# Altium schematic sheet D02-2-00 Circuit Top Sheet.SchDoc
size A3; SheetNumber: 1; SheetTotal: 3
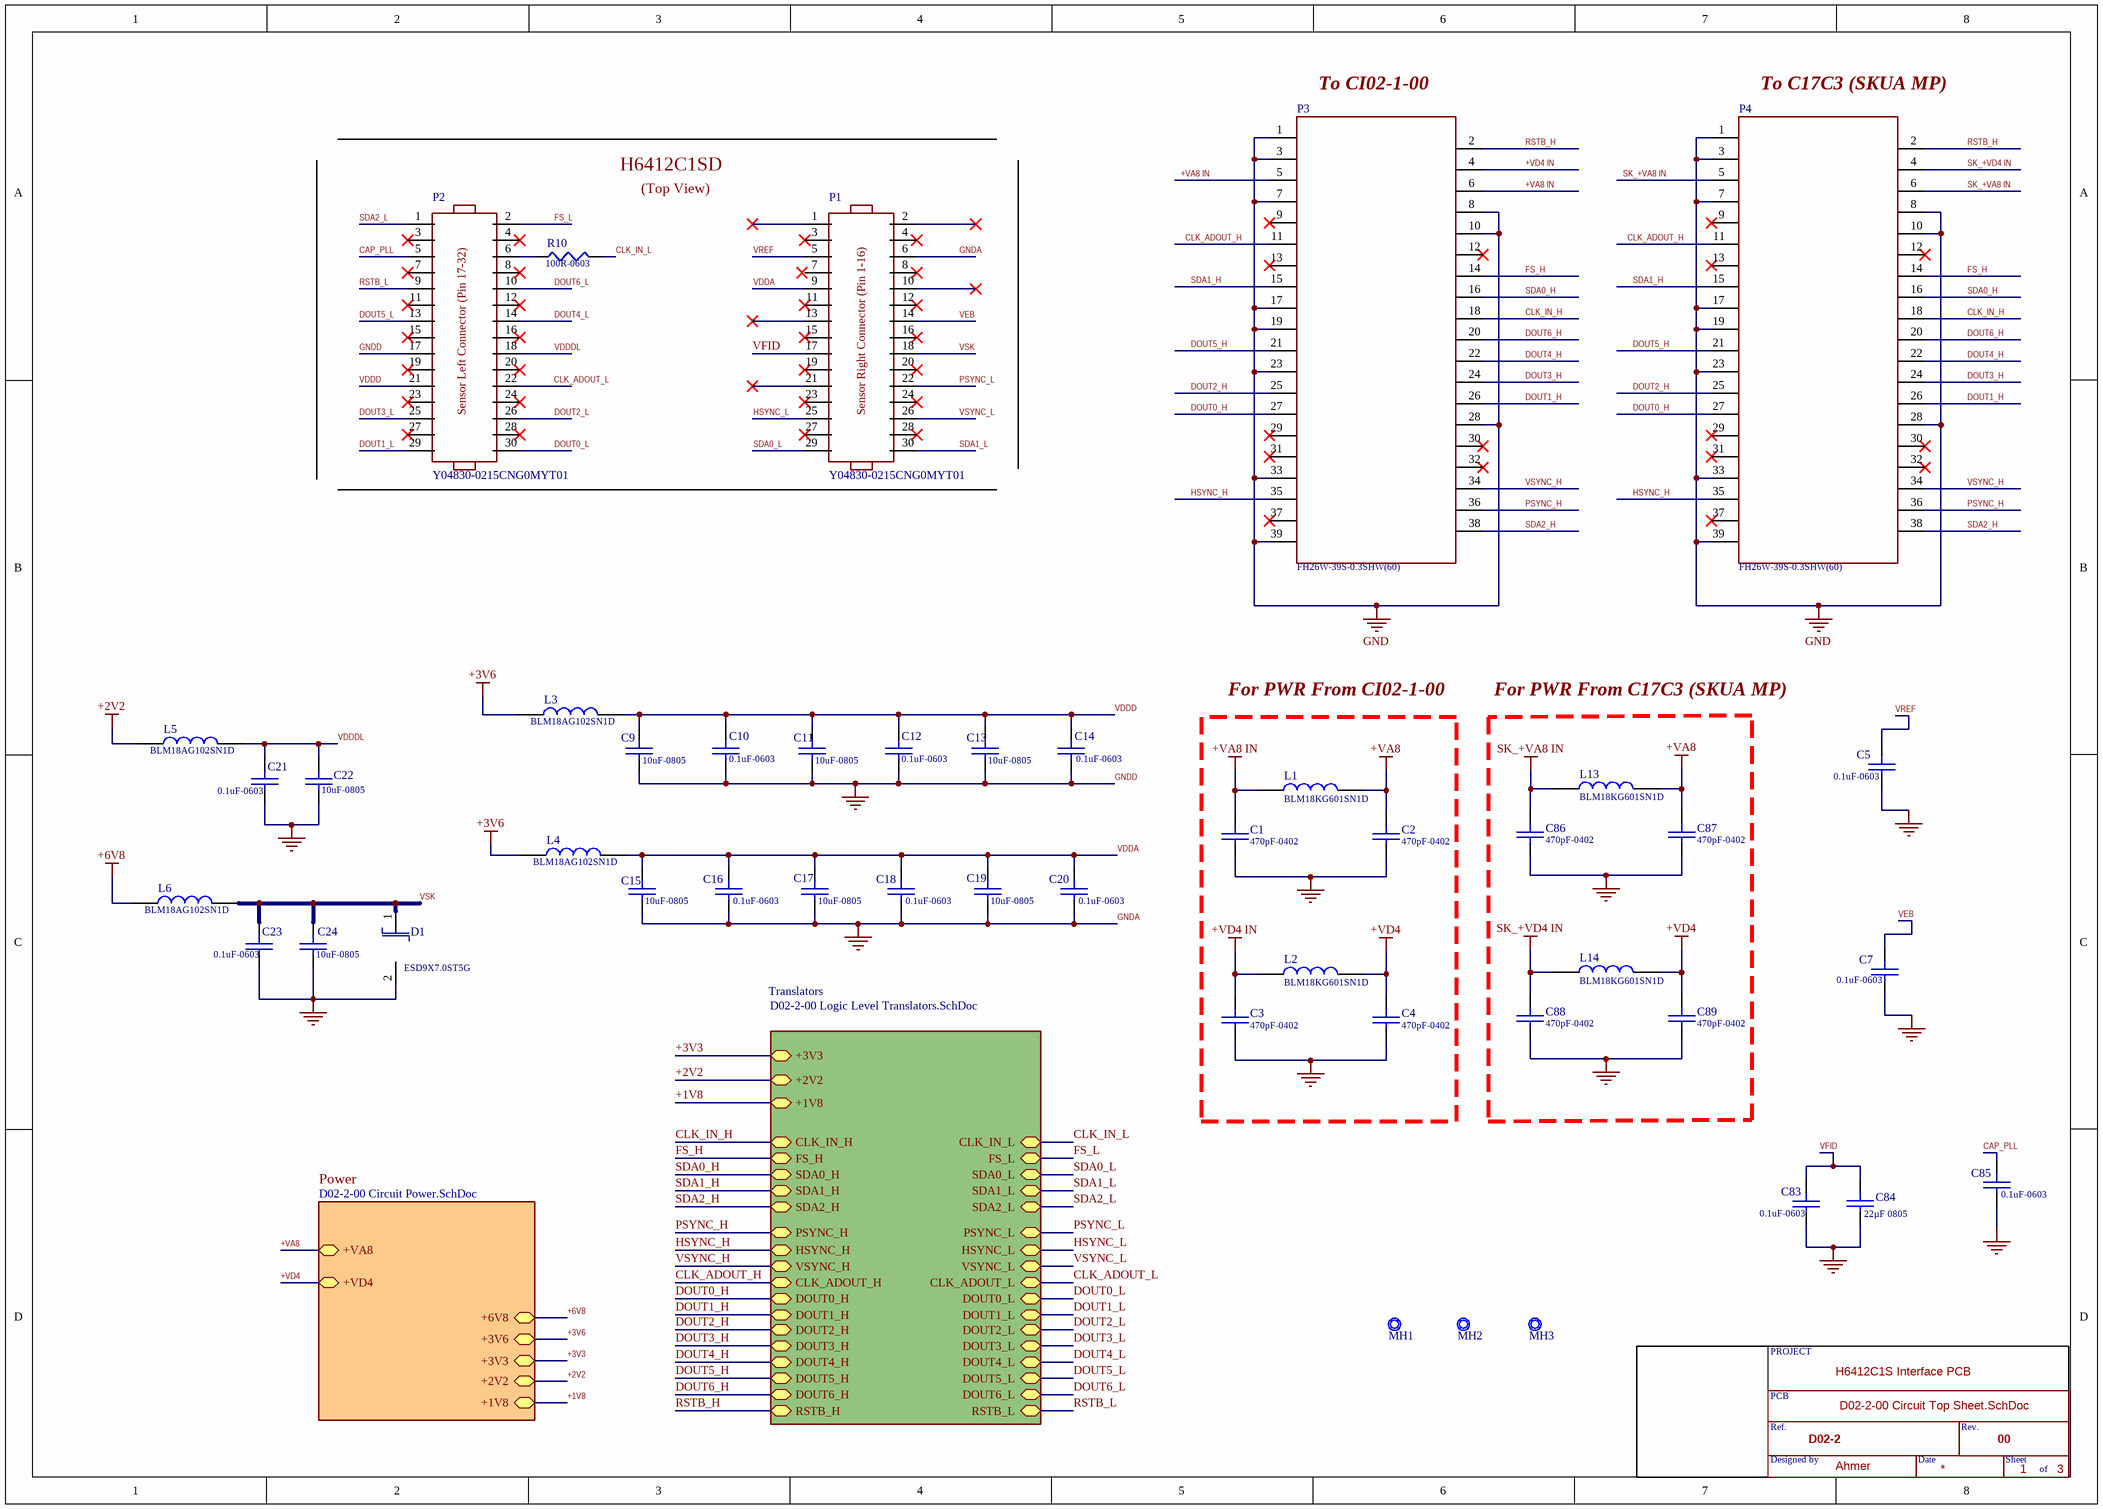
[diagram p0: D02-2-00 Circuit Top Sheet.SchDoc]

## Parts
*?  Title Box  (value not drawn)
C1  470pF-0402  [C0402 - C0402C104J4RACTU]
C2  470pF-0402  [C0402 - C0402C104J4RACTU]
C3  470pF-0402  [C0402 - C0402C104J4RACTU]
C4  470pF-0402  [C0402 - C0402C104J4RACTU]
C5  0.1uF-0603  [C0603X104J4RECAUTO]
C7  0.1uF-0603  [C0603X104J4RECAUTO]
C9  10uF-0805  [C0805]
C10  0.1uF-0603  [C0603X104J4RECAUTO]
C11  10uF-0805  [C0805]
C12  0.1uF-0603  [C0603X104J4RECAUTO]
C13  10uF-0805  [C0805]
C14  0.1uF-0603  [C0603X104J4RECAUTO]
C15  10uF-0805  [C0805]
C16  0.1uF-0603  [C0603X104J4RECAUTO]
C17  10uF-0805  [C0805]
C18  0.1uF-0603  [C0603X104J4RECAUTO]
C19  10uF-0805  [C0805]
C20  0.1uF-0603  [C0603X104J4RECAUTO]
C21  0.1uF-0603  [C0603X104J4RECAUTO]
C22  10uF-0805  [C0805]
C23  0.1uF-0603  [C0603X104J4RECAUTO]
C24  10uF-0805  [C0805]
C83  0.1uF-0603  [C0603X104J4RECAUTO]
C84  22µF 0805  [C-0805]
C85  0.1uF-0603  [C0603X104J4RECAUTO]
C86  470pF-0402  [C0402 - C0402C104J4RACTU]
C87  470pF-0402  [C0402 - C0402C104J4RACTU]
C88  470pF-0402  [C0402 - C0402C104J4RACTU]
C89  470pF-0402  [C0402 - C0402C104J4RACTU]
D1  ESD9X7.0ST5G  [SOD-923 for ESD9X12ST5G]
L1  BLM18KG601SN1D  [BLM18K]
L2  BLM18KG601SN1D  [BLM18K]
L3  BLM18AG102SN1D  [BLM18AG102SN1D]
L4  BLM18AG102SN1D  [BLM18AG102SN1D]
L5  BLM18AG102SN1D  [BLM18AG102SN1D]
L6  BLM18AG102SN1D  [BLM18AG102SN1D]
L13  BLM18KG601SN1D  [BLM18K]
L14  BLM18KG601SN1D  [BLM18K]
MH1  Mounting Hole 3.2-2.5  [MH 3.2mm-2.5mm]  (value not drawn)
MH2  Mounting Hole 3.2-2.5  [MH 3.2mm-2.5mm]  (value not drawn)
MH3  Mounting Hole 3.2-2.5  [MH 3.2mm-2.5mm]  (value not drawn)
P1  Y04830-0215CNG0MYT01  [Y04830-0215CNG0MYT01]
P2  Y04830-0215CNG0MYT01  [Y04830-0215CNG0MYT01]
P3  FH26W-39S-0.3SHW(60)  [FH26W-39S-0.3SHW(60)]
P4  FH26W-39S-0.3SHW(60)  [FH26W-39S-0.3SHW(60)]
R10  100R-0603  [R0603]

## Sub-sheets
Power = D02-2-00 Circuit Power.SchDoc: +VA8 (bidir), +VD4 (bidir), +6V8 (bidir), +3V6 (bidir), +3V3 (bidir), +2V2 (bidir), +1V8 (bidir)
Translators = D02-2-00 Logic Level Translators.SchDoc: +1V8 (bidir), CLK_IN_H (bidir), FS_H (bidir), SDA1_H (bidir), +2V2 (bidir), SDA0_H (bidir), SDA2_H (bidir), PSYNC_H (bidir), HSYNC_H (bidir), VSYNC_H (bidir), CLK_ADOUT_H (bidir), DOUT0_H (bidir), DOUT1_H (bidir), DOUT2_H (bidir), DOUT3_H (bidir), DOUT4_H (bidir), DOUT5_H (bidir), DOUT6_H (bidir), RSTB_H (bidir), CLK_IN_L (bidir), FS_L (bidir), SDA1_L (bidir), SDA0_L (bidir), SDA2_L (bidir), PSYNC_L (bidir), HSYNC_L (bidir), VSYNC_L (bidir), CLK_ADOUT_L (bidir), DOUT0_L (bidir), DOUT1_L (bidir), DOUT2_L (bidir), DOUT3_L (bidir), DOUT4_L (bidir), DOUT5_L (bidir), DOUT6_L (bidir), RSTB_L (bidir), +3V3 (bidir)

## Nets
+2V2: L5.1 ; sheet Power/+2V2, sheet Translators/+2V2
+3V6: L3.1 L4.1 ; sheet Power/+3V6
+6V8: L6.1 ; sheet Power/+6V8
+VA8: C2.2 C87.2 L1.2 L13.2 ; sheet Power/+VA8
+VA8 IN: C1.2 L1.1 P3.5 P3.6
+VD4: C4.2 C89.2 L2.2 L14.2 ; sheet Power/+VD4
+VD4 IN: C3.2 L2.1 P3.4
GNDA: C1.1 C2.1 C3.1 C4.1 C5.1 C7.1 C9.1 C10.1 C11.1 C12.1 C13.1 C14.1 C15.1 C16.1 C17.1 C18.1 C19.1 C20.1 C21.1 C22.1 C23.1 C24.1 C83.1 C84.1 C85.1 C86.1 C87.1 C88.1 C89.1 D1.2(A) P1.6 P2.17 P3.1 P3.3 P3.7 P3.8 P3.10 P3.17 P3.19 P3.23 P3.28 P3.33 P3.39 P4.1 P4.3 P4.7 P4.8 P4.10 P4.17 P4.19 P4.23 P4.28 P4.33 P4.39  [also labelled GND, GNDD]
SK_+VA8 IN: C86.2 L13.1 P4.5 P4.6
SK_+VD4 IN: C88.2 L14.1 P4.4
+1V8: sheet Power/+1V8, sheet Translators/+1V8
+3V3: sheet Power/+3V3, sheet Translators/+3V3
CAP_PLL: C85.2 P2.5
CLK_ADOUT_H: P3.11 P4.11 ; sheet Translators/CLK_ADOUT_H
CLK_ADOUT_L: P2.22 ; sheet Translators/CLK_ADOUT_L
CLK_IN_H: P3.18 P4.18 ; sheet Translators/CLK_IN_H
CLK_IN_L: R10.2 ; sheet Translators/CLK_IN_L
DOUT0_H: P3.27 P4.27 ; sheet Translators/DOUT0_H
DOUT0_L: P2.30 ; sheet Translators/DOUT0_L
DOUT1_H: P3.26 P4.26 ; sheet Translators/DOUT1_H
DOUT1_L: P2.29 ; sheet Translators/DOUT1_L
DOUT2_H: P3.25 P4.25 ; sheet Translators/DOUT2_H
DOUT2_L: P2.26 ; sheet Translators/DOUT2_L
DOUT3_H: P3.24 P4.24 ; sheet Translators/DOUT3_H
DOUT3_L: P2.25 ; sheet Translators/DOUT3_L
DOUT4_H: P3.22 P4.22 ; sheet Translators/DOUT4_H
DOUT4_L: P2.14 ; sheet Translators/DOUT4_L
DOUT5_H: P3.21 P4.21 ; sheet Translators/DOUT5_H
DOUT5_L: P2.13 ; sheet Translators/DOUT5_L
DOUT6_H: P3.20 P4.20 ; sheet Translators/DOUT6_H
DOUT6_L: P2.10 ; sheet Translators/DOUT6_L
FS_H: P3.14 P4.14 ; sheet Translators/FS_H
FS_L: P2.2 ; sheet Translators/FS_L
HSYNC_H: P3.35 P4.35 ; sheet Translators/HSYNC_H
HSYNC_L: P1.25 ; sheet Translators/HSYNC_L
PSYNC_H: P3.36 P4.36 ; sheet Translators/PSYNC_H
PSYNC_L: P1.22 ; sheet Translators/PSYNC_L
RSTB_H: P3.2 P4.2 ; sheet Translators/RSTB_H
RSTB_L: P2.9 ; sheet Translators/RSTB_L
SDA0_H: P3.16 P4.16 ; sheet Translators/SDA0_H
SDA0_L: P1.29 ; sheet Translators/SDA0_L
SDA1_H: P3.15 P4.15 ; sheet Translators/SDA1_H
SDA1_L: P1.30 ; sheet Translators/SDA1_L
SDA2_H: P3.38 P4.38 ; sheet Translators/SDA2_H
SDA2_L: P2.1 ; sheet Translators/SDA2_L
VDDA: C15.2 C16.2 C17.2 C18.2 C19.2 C20.2 L4.2 P1.9
VDDD: C9.2 C10.2 C11.2 C12.2 C13.2 C14.2 L3.2 P2.21
VDDDL: C21.2 C22.2 L5.2 P2.18
VEB: C7.2 P1.14
VFID: C83.2 C84.2 P1.17
VREF: C5.2 P1.5
VSK: C23.2 C24.2 D1.1(C) L6.2 P1.18
VSYNC_H: P3.34 P4.34 ; sheet Translators/VSYNC_H
VSYNC_L: P1.26 ; sheet Translators/VSYNC_L
NetP2_6: P2.6 R10.1

Not connected (* = marked no-connect by the designer): P1 1* 2* 3* 4* 7 8* 10* 11* 12* 13* 15* 16* 19* 20* 21* 23* 24* 27* 28*; P2 3* 4* 7* 8* 11* 12* 15* 16* 19* 20* 23* 24* 27* 28*; P3 9* 12* 13* 29* 30* 31* 32* 37*; P4 9* 12* 13* 29* 30* 31* 32* 37*

## Notes on the sheet
- (near P3) To CI02-1-00
- (near P4) To C17C3 (SKUA MP)
- H6412C1SD
- (Top View)
- (near P2) Sensor Left Connector (Pin 17-32)
- (near P1) Sensor Right Connector (Pin 1-16)
- For PWR From CI02-1-00
- For PWR From C17C3 (SKUA MP)
- (in symbol Title Box) PROJECT; H6412C1S Interface PCB; PCB; Ref.; Rev.; D02-2; 00; Designed by; Date; Sheet; Ahmer; of

## Library data of the parts
C1-C4 C86-C89 = C0402C471J4RACTU: 470pF, 16V, ±5%, X7R, 0402; Manufacturer: KEMET; Part # Aliases: C0402C471J4RAC7867; Capacitance - nF: 0.47 nF; Case Height: 0.5 mm; Case Length: 1 mm; Class: 2; Dissipation Factor DF: 3.5; Temperature Coefficient / Code: +/- 15 %; Type: SMD MLCCs X7R, Commercial; Supplier 1: Digi-Key; Manufacturer Part Number: C0402C471J4RACTU; Stock 1: 12411; Pricing 1: 1=0.39, 10=0.271, 100=0.1624, 500=0.1218, 1000=0.1029, 2500=0.0975, 5000=0.092 (USD); Dimensions: 0.5 mm W x 1 mm L x 0.5 mm H; Voltage Rating: 16 V; Product Category: Multilayer Ceramic Capacitors MLCC - SMD/SMT; RoHS: Details; Brand: Kemet; Capacitance: 470 pF; Voltage Rating DC: 16 V; Tolerance: 5 %; Dielectric: X7R; Case Code - in: 0402; Case Code - mm: 1005; Minimum Operating Temperature: - 55 C; Maximum Operating Temperature: + 125 C; Product: General Type MLCCs; Case Width: 0.5 mm; Lead Spacing: 0.3 mm; Operating Temperature Range: - 55 C to + 125 C; Package / Case: 0402 (1005 metric); Packaging: Reel; Series: C0402C; Factory Pack Quantity: 10000; Termination Style: SMD/SMT; ComponentLink1URL: https://search.kemet.com/component-edge/download/datasheet/C0402C471J4RACTU.pdf?src-supplier=Digi-Key; ComponentLink1Description: https://search.kemet.com/component-edge/download/datasheet/C0402C471J4RACTU.pdf?src-supplier=Digi-Key; ComponentLink2URL: http://components.arrow.com/part/dataview/3442411S8455324N7429?src-supplier=Arrow; ComponentLink2Description: http://components.arrow.com/part/dataview/3442411S8455324N7429?src-supplier=Arrow; ComponentLink3URL: http://www.farnell.com/datasheets/2749617.pdf?src-supplier=Newark; ComponentLink3Description: http://www.farnell.com/datasheets/2749617.pdf?src-supplier=Newark; ComponentLink4URL: http://www.farnell.com/datasheets/2749617.pdf?src-supplier=Farnell; ComponentLink4Description: http://www.farnell.com/datasheets/2749617.pdf?src-supplier=Farnell; ComponentLink5URL: http://www.mouser.com/ds/2/212/KEM_C1002_X7R_SMD-1102033.pdf?src-supplier=Mouser; ComponentLink5Description: http://www.mouser.com/ds/2/212/KEM_C1002_X7R_SMD-1102033.pdf?src-supplier=Mouser; ComponentLink6URL: https://api.kemet.com/component-edge/download/datasheet/C0402C471J4RACTU.pdf?src-supplier=Digi-Key; ComponentLink6Description: https://api.kemet.com/component-edge/download/datasheet/C0402C471J4RACTU.pdf?src-supplier=Digi-Key; Supplier Part Number 1: 399-8966-1-ND
C5 C7 C10 C12 C14 C16 C18 C20 C21 C23 C83 C85 = C0603X104J4RECAUTO: 0.1uF ±5% 16V X7R 0603 (1608 Metric); Manufacturer: KEMET; Supplier 1: Digi-Key; Manufacturer Part Number: C0603X104J4RECAUTO; Stock 1: 13235; Pricing 1: 1=0.24, 10=0.161, 50=0.0966, 100=0.0816, 500=0.0559, 1000=0.0494 (USD); ComponentLink1URL: https://api.kemet.com/component-edge/download/datasheet/C0603X104J4RECAUTO.pdf?src-supplier=Digi-Key; ComponentLink1Description: https://api.kemet.com/component-edge/download/datasheet/C0603X104J4RECAUTO.pdf?src-supplier=Digi-Key; ComponentLink2URL: http://www.farnell.com/datasheets/2743696.pdf?src-supplier=Farnell; ComponentLink2Description: http://www.farnell.com/datasheets/2743696.pdf?src-supplier=Farnell; ComponentLink3URL: http://www.farnell.com/datasheets/2743696.pdf?src-supplier=Newark; ComponentLink3Description: http://www.farnell.com/datasheets/2743696.pdf?src-supplier=Newark; Supplier Part Number 1: 399-17843-1-ND
C9 C11 C13 C15 C17 C19 C22 C24 = CAP-0805
C84 = GRM219R61A226MEA0D: CC 22µF 0805 10V ±20% X5R; Manufacturer: Murata; Dielectric Material: Ceramic; Dissipation Factor: 0.035%; Capacitance: 22uF; Supplier 1: Digi-Key; Manufacturer Part Number: GRM219R61A226MEA0D; RoHS: Yes; Category: Ceramic Capacitors; Stock 1: 93694; Pricing 1: 1=0.52000, 10=0.36400, 50=0.25480, 100=0.21840, 500=0.16378, 1000=0.13831 (USD); Mount: Surface Mount; Case/Package: 0805; Case Code (Metric): 2012; Case Code (Imperial): 0805; Min Operating Temperature: -55°C; Max Operating Temperature: 85°C; Tolerance: 20%; Dielectric: X5R; Voltage Rating (DC): 10V; Packaging: Cut Tape; Voltage Rating: 10V; Voltage: 10V; Termination: SMD/SMT; Length: 0.079inch; Width: 0.049inch; Height: 0.85mm; Thickness: 0.037inch; Depth: 1.25mm; REACH SVHC: No SVHC; RoHS Compliant: Yes; ComponentLink1URL: http://www.farnell.com/datasheets/2079175.pdf?src-supplier=Farnell; ComponentLink1Description: http://www.farnell.com/datasheets/2079175.pdf?src-supplier=Farnell; ComponentLink2URL: http://search.murata.co.jp/Ceramy/image/img/A01X/G101/ENG/GRM219R61A226MEA0-01.pdf?src-supplier=Avnet+Europe; ComponentLink2Description: http://search.murata.co.jp/Ceramy/image/img/A01X/G101/ENG/GRM219R61A226MEA0-01.pdf?src-supplier=Avnet+Europe; ComponentLink3URL: http://www.farnell.com/datasheets/2079175.pdf?src-supplier=Newark; ComponentLink3Description: http://www.farnell.com/datasheets/2079175.pdf?src-supplier=Newark; ComponentLink4URL: http://search.murata.co.jp/Ceramy/image/img/A01X/G101/ENG/GRM219R61A226MEA0-01.pdf?src-supplier=Mouser; ComponentLink4Description: http://search.murata.co.jp/Ceramy/image/img/A01X/G101/ENG/GRM219R61A226MEA0-01.pdf?src-supplier=Mouser; ComponentLink5URL: http://search.murata.co.jp/Ceramy/image/img/A01X/G101/ENG/GRM219R61A226MEA0-01.pdf?src-supplier=Avnet; ComponentLink5Description: http://search.murata.co.jp/Ceramy/image/img/A01X/G101/ENG/GRM219R61A226MEA0-01.pdf?src-supplier=Avnet; ComponentLink6URL: http://search.murata.co.jp/Ceramy/image/img/A01X/G101/ENG/GRM219R61A226MEA0-01.pdf?src-supplier=Digi-Key; ComponentLink6Description: http://search.murata.co.jp/Ceramy/image/img/A01X/G101/ENG/GRM219R61A226MEA0-01.pdf?src-supplier=Digi-Key; ComponentLink7URL: http://www.farnell.com/datasheets/2079175.pdf?src-supplier=Element14; ComponentLink7Description: http://www.farnell.com/datasheets/2079175.pdf?src-supplier=Element14; ComponentLink8URL: http://search.murata.co.jp/Ceramy/image/img/A01X/G101/ENG/GRM219R61A226MEA0-01.pdf?src-supplier=RSComponents; ComponentLink8Description: http://search.murata.co.jp/Ceramy/image/img/A01X/G101/ENG/GRM219R61A226MEA0-01.pdf?src-supplier=RSComponents; ComponentLink9URL: http://search.murata.co.jp/Ceramy/image/img/A01X/G101/ENG/GRM219R61A226MEA0-01.pdf?src-supplier=Area51; ComponentLink9Description: http://search.murata.co.jp/Ceramy/image/img/A01X/G101/ENG/GRM219R61A226MEA0-01.pdf?src-supplier=Area51; ComponentLink10URL: http://search.murata.co.jp/Ceramy/image/img/A01X/G101/ENG/GRM219R61A226MEA0-01.pdf?src-supplier=Quest; ComponentLink10Description: http://search.murata.co.jp/Ceramy/image/img/A01X/G101/ENG/GRM219R61A226MEA0-01.pdf?src-supplier=Quest; ComponentLink11URL: http://search.murata.co.jp/Ceramy/image/img/A01X/G101/ENG/GRM219R61A226MEA0-01.pdf?src-supplier=TTI; ComponentLink11Description: http://search.murata.co.jp/Ceramy/image/img/A01X/G101/ENG/GRM219R61A226MEA0-01.pdf?src-supplier=TTI; Supplier Part Number 1: 490-9951-1-ND
D1 = ESD9X7.0ST5G: DIODE TVS 7VWM 25VC SOD923 ESD9X7.0 Series 25 V 65 pF SMT Transient Voltage Suppressor - SOD-923; Manufacturer: ON Semiconductor; Capacitance: 65pF; Operating Supply Voltage: 7V; Max Surge Current: 4A; Direction: Unidirectional; Breakdown Voltage: 7.5V; Clamping Voltage: 25V; Number of Channels: 1; Peak Pulse Power: 150mW; Power Line Protection: No; Leakage Current: 100nA; ESD Protection: Yes; Test Current: 1mA; Element Configuration: Single; Max Power Dissipation: 100W; Diode Type: ZENER; Supplier 1: Digi-Key; Supplier Part Number 1: ESD9X7.0ST5GOSCT-ND; Manufacturer Part Number: ESD9X7.0ST5G; RoHS: Yes; Category: ESD and Circuit Protection ICs; Stock: 7900; Pricing: 1=0.25000, 10=0.20200, 100=0.10690, 500=0.07036, 1000=0.04784, 2000=0.04316 (USD); Case/Package: SOD-923-2; Number of Pins: 2; Min Operating Temperature: -55°C; Max Operating Temperature: 150°C; Package Quantity: 8000; Packaging: Tape and Reel; Polarity: Unidirectional; Termination: SMD/SMT; Number of Unidirectional Channels: 1; Reverse Standoff Voltage: 7V; Min Breakdown Voltage: 7.5V; Working Voltage: 7V; Max Reverse Leakage Current: 100nA; Number of Lines: 1; Peak Pulse Current: 4A; Resistor Type: Zener; Series: Automotive, AEC-Q101; Length: 0.8mm; Width: 0.65mm; Height: 0.43mm; Depth: 0.6mm; Radiation Hardening: No; Lead Free: Lead Free; Halogen Free: Halogen Free; RoHS Compliant: Yes; ComponentLink1URL: https://datasheet.ciiva.com/4507/esd9x3-3st5g-d-241605-4507808.pdf?src-supplier=Mouser; ComponentLink1Description: https://datasheet.ciiva.com/4507/esd9x3-3st5g-d-241605-4507808.pdf?src-supplier=Mouser; ComponentLink2URL: https://datasheet.ciiva.com/353/esd9x3-3st5g-d-353788.pdf?src-supplier=Digi-Key; ComponentLink2Description: https://datasheet.ciiva.com/353/esd9x3-3st5g-d-353788.pdf?src-supplier=Digi-Key
L1 L2 L13 L14 = BLM18KG601SN1D: Ind Chip Bead 600 Ohm 25% 100MHz Ferrite 1.3A 0603 Paper T/R; Manufacturer: Murata; Catalog Drawings: BLM18 Series Top BLM18(A,B,E,H,P,R) Series Side; Featured Product: High Current Power Chip Ferrite Bead; Filter Type: Power Line; Number of Lines: 1; Impedance @ Frequency: 600 Ohm @ 100MHz; DC Resistance (DCR) (Max): 150 mOhm; Online Catalog: EMIFIL® BLM18K Series; Kits: 490-5243-ND  - KIT FERRITE CHIP BLM 0603; Other Names: 490-5258-1; Supplier 1: Digi-Key; Stock 1: 450248; Pricing 1: 1=0.1, 10=0.079, 25=0.0712, 50=0.0522, 100=0.0451, 250=0.0356, 500=0.0301, 1000=0.0253 (USD); Standard Package: 1; Category: Filters; Family: Ferrite Beads and Chips; Series: BLM18K; Packaging: Cut Tape (CT); Current Rating (Max): 1.3A; Ratings: -; Operating Temperature: -55°C ~ 125°C; Package / Case: 0603 (1608 Metric); Mounting Type: Surface Mount; Height (Max): 0.037" (0.95mm); Size / Dimension: 0.063" L x 0.031" W (1.60mm x 0.80mm); ComponentLink1URL: https://www.verical.com/server-webapp/html/getDatasheet?partID=226848&src-supplier=Verical; ComponentLink1Description: https://www.verical.com/server-webapp/html/getDatasheet?partID=226848&src-supplier=Verical; ComponentLink2URL: http://www.murata.com/products/catalog/pdf/c31e.pdf?src-supplier=Element14; ComponentLink2Description: http://www.murata.com/products/catalog/pdf/c31e.pdf?src-supplier=Element14; ComponentLink3URL: https://media.digikey.com/pdf/Data%20Sheets/Murata%20PDFs/BLM18yyyyyyN1x.pdf?src-supplier=Digi-Key; ComponentLink3Description: https://media.digikey.com/pdf/Data%20Sheets/Murata%20PDFs/BLM18yyyyyyN1x.pdf?src-supplier=Digi-Key; ComponentLink4URL: http://uk.rs-online.com/webdocs/13ed/0900766b813ed050.pdf?src-supplier=RSComponents; ComponentLink4Description: http://uk.rs-online.com/webdocs/13ed/0900766b813ed050.pdf?src-supplier=RSComponents; Supplier Part Number 1: 490-5258-1-ND; Manufacturer Part Number: BLM18KG601SN1D
L3-L6 = BLM18AG102SN1D: Ferrite Beads Multi-Layer 1KOhm 25% 100MHz 400mA 500mOhm DCR 0603 Paper T/R; Manufacturer: Murata; Product Training Modules: Ferrite Beads and Arrays; Catalog Drawings: BLM18 Series Top BLM18(A,B,E,H,P,R) Series Side; EDA / CAD Models: Download from Accelerated Designs; Number of Lines: 1; Impedance @ Frequency: 1 kOhm @ 100MHz; Online Catalog: EMIFIL® BLM18A Series; Kits: 490-5243-ND  - KIT FERRITE CHIP BLM 0603; Other Names: 490-1015-1; Supplier 1: Digi-Key; Stock 1: 505950; Pricing 1: 1=0.1, 10=0.079, 25=0.072, 50=0.0648, 100=0.0476, 250=0.0346, 500=0.0317, 1000=0.0274 (USD); Standard Package: 1; Category: Filters; Family: Ferrite Beads and Chips; Series: BLM18A; Packaging: Cut Tape (CT); Filter Type: -; Current Rating (Max): 400mA; DC Resistance (DCR) (Max): 500 mOhm; Ratings: -; Operating Temperature: -55°C ~ 125°C; Package / Case: 0603 (1608 Metric); Mounting Type: Surface Mount; Height (Max): 0.037" (0.95mm); Size / Dimension: 0.063" L x 0.031" W (1.60mm x 0.80mm); ComponentLink1URL: https://www.murata.com/en-us/products/productdata/8796738650142/ENFA0003.pdf?src-supplier=Digi-Key; ComponentLink1Description: https://www.murata.com/en-us/products/productdata/8796738650142/ENFA0003.pdf?src-supplier=Digi-Key; ComponentLink2URL: http://www.farnell.com/datasheets/1756147.pdf?src-supplier=Farnell; ComponentLink2Description: http://www.farnell.com/datasheets/1756147.pdf?src-supplier=Farnell; ComponentLink3URL: http://www.farnell.com/datasheets/1756147.pdf?src-supplier=Element14; ComponentLink3Description: http://www.farnell.com/datasheets/1756147.pdf?src-supplier=Element14; ComponentLink4URL: http://search.murata.co.jp/Ceramy/image/img/PDF/ENG/L0110S0100BLM18A.pdf?src-supplier=Avnet+Europe; ComponentLink4Description: http://search.murata.co.jp/Ceramy/image/img/PDF/ENG/L0110S0100BLM18A.pdf?src-supplier=Avnet+Europe; ComponentLink5URL: http://search.murata.co.jp/Ceramy/image/img/PDF/ENG/L0110S0100BLM18A.pdf?src-supplier=Future+Electronics; ComponentLink5Description: http://search.murata.co.jp/Ceramy/image/img/PDF/ENG/L0110S0100BLM18A.pdf?src-supplier=Future+Electronics; ComponentLink6URL: http://search.murata.co.jp/Ceramy/image/img/PDF/ENG/L0110S0100BLM18A.pdf?src-supplier=Avnet; ComponentLink6Description: http://search.murata.co.jp/Ceramy/image/img/PDF/ENG/L0110S0100BLM18A.pdf?src-supplier=Avnet; ComponentLink7URL: http://uk.rs-online.com/webdocs/1388/0900766b813885e7.pdf?src-supplier=RSComponents; ComponentLink7Description: http://uk.rs-online.com/webdocs/1388/0900766b813885e7.pdf?src-supplier=RSComponents; ComponentLink8URL: http://www.produktinfo.conrad.com/datenblaetter/1100000-1199999/001172220-da-01-en-DROSSEL_0603_1000R_1_6X0_8MM_4000ST.pdf?src-supplier=Conrad; ComponentLink8Description: http://www.produktinfo.conrad.com/datenblaetter/1100000-1199999/001172220-da-01-en-DROSSEL_0603_1000R_1_6X0_8MM_4000ST.pdf?src-supplier=Conrad; ComponentLink9URL: http://www.produktinfo.conrad.com/datenblaetter/425000-449999/442253-da-01-en-CHIP_DROSSEL_0603_1000R_400MA_1_6X0_8MM.pdf?src-supplier=Conrad; ComponentLink9Description: http://www.produktinfo.conrad.com/datenblaetter/425000-449999/442253-da-01-en-CHIP_DROSSEL_0603_1000R_400MA_1_6X0_8MM.pdf?src-supplier=Conrad; Supplier Part Number 1: 490-1015-6-ND; Manufacturer Part Number: BLM18AG102SN1D
MH1-MH3 = Mounting Hole 3.2-2.5: Mounting Hole with 2.5mm Dia Hole and 3.2mm Dia Copper ring around it
P1 P2 = Y04830-0215CNG0MYT01: CONN Y04830-0215CNG0MYT01 for H6417C1S; Manufacturer: Yinghua; Manufacturer Prt No.: Y04830-0215CNG0MYT01
P3 P4 = FH26W-39S-0.3SHW(60): CONN FPC BOTTOM 39POS 0.3MM
R10 = RMCF0603FT100R: Res 100 Ohm 0603 1% 0.1W(1/10W) ±100ppm/C Pad SMD Automotive T/R; Manufacturer: Stackpole Electronics; Resistance (Ohms): 100; Power (Watts): 0.1W, 1/10W; Temperature Coefficient: ±100ppm/°C; Supplier 1: Digi-Key; Manufacturer Part Number: RMCF0603FT100R; Stock 1: 1208013; Pricing 1: 1=0.1, 10=0.016, 100=0.0065, 1000=0.0029, 2500=0.0025 (USD); Category: Resistors; Family: Chip Resistor - Surface Mount; Series: RMCF; Packaging: Cut Tape (CT); Tolerance: ±1%; Composition: Thick Film; Features: Automotive AEC-Q200; Operating Temperature: -55°C ~ 155°C; Package / Case: 0603 (1608 Metric); Supplier Device Package: 0603; Size / Dimension: 0.061" L x 0.031" W (1.55mm x 0.80mm); Height: 0.022" (0.55mm); Number of Terminations: 2; ComponentLink1URL: https://www.verical.com/server-webapp/html/getDatasheet?partID=360413&src-supplier=Verical; ComponentLink1Description: https://www.verical.com/server-webapp/html/getDatasheet?partID=360413&src-supplier=Verical; Supplier Part Number 1: RMCF0603FT100RCT-ND